# Altium schematic sheet Power.SchDoc
size A4
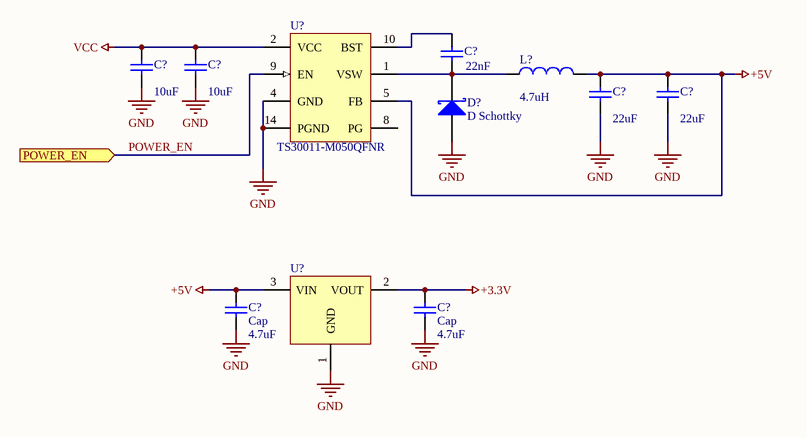
[diagram p0: Power.SchDoc]

## Parts
(Parts that share a designator on the sheet are numbered #1, #2 ... from top to bottom, then left to right.)
C?#1  value 22nF  [RAD-0.3]  (hidden comment: Cap)
C?#2  value 10uF  [RAD-0.3]  (hidden comment: Cap)
C?#3  value 10uF  [RAD-0.3]  (hidden comment: Cap)
C?#4  value 22uF  [RAD-0.3]  (hidden comment: Cap)
C?#5  value 22uF  [RAD-0.3]  (hidden comment: Cap)
C?#6  Cap  value 4.7uF  [RAD-0.3]
C?#7  Cap  value 4.7uF  [RAD-0.3]
D?  D Schottky  [SMB]
L?  value 4.7uH  [0402-A]  (hidden comment: Inductor)
U?#1  TS30011-M050QFNR  [QFN50P300X300X100_HS-17N]
U?#2  AP2114H-3.3TRG1  [SOT230P700X180-4N]  (value not drawn)

## Ports
POWER_EN (in)

## Nets
+3.3V: C?#7.2 U?#2.2(VOUT)
+5V: C?#4.2 C?#5.2 C?#6.2 L?.2 U?#1.5(FB) U?#2.3(VIN)
GND: C?#2.1 C?#3.1 C?#4.1 C?#5.1 C?#6.1 C?#7.1 D?.1(A) U?#1.4(GND) U?#1.14(PGND) U?#2.1(GND)
VCC: C?#2.2 C?#3.2 U?#1.2(VCC)
POWER_EN: U?#1.9(EN) ; port POWER_EN
NetC?#1_1: C?#1.1 D?.2(K) L?.1 U?#1.1(VSW)
NetC?#1_2: C?#1.2 U?#1.10(BST)

Not connected (* = marked no-connect by the designer): U?#1 3(VCC) 8(PG) 11(VCC) 12(VSW) 13(VSW) 15(PGND) 16(VSW)

## Library data of the parts
C?#1-C?#7 = Cap: Capacitor; Published: 8-Jun-2000; LatestRevisionDate: 17-Jul-2002; LatestRevisionNote: Re-released for DXP Platform.; PackageReference: RAD-0.3; Publisher: Altium Limited; PackageDescription: Radial Cap, Thru-Hole; 2 Leads; 0.3 in Pin Spacing
D? = D Schottky: Schottky Diode; Published: 8-Jun-2000; LatestRevisionDate: 17-Jul-2002; LatestRevisionNote: Re-released for DXP Platform.; PackageReference: SMB; Publisher: Altium Limited; PackageDescription: DO-214-AA/SMB; 2 C-Bend Leads; Body 5.3 x 3.6 mm, inc. leads (LxW); Code_JEDEC: DO-214-AA
L? = Inductor: Code_IEC: 1005; Published: 8-Jun-2000; LatestRevisionDate: 29-May-2009; LatestRevisionNote: IPC-7351 Footprint Added.; PackageReference: 0402-A; Publisher: Altium Limited; PackageDescription: Chip Inductor; Code_JEITA: 0402
U?#1 = TS30011-M050QFNR: Voltage Regulators - Switching Regulators IC Hi-Eff 1Amp DC/DC Conv 1MHz 5V Outpt; Manufacturer: Triune Systems; Max Input Voltage: 24V; Output Current: 1A; Min Input Voltage: 6V; Number of Outputs: 1; Efficiency: 95%; Supplier 1: Digi-Key; Manufacturer Part Number: TS30011-M050QFNR; Mount: Surface Mount; Case/Package: DFN EP; Number of Pins: 16; Min Operating Temperature: -40°C; Max Operating Temperature: 125°C; Packaging: Tape and Reel; Switching Frequency: 1MHz; Output Voltage: 5V; Package Quantity: 1000; Radiation Hardening: No; ComponentLink1URL: https://datasheet.ciiva.com/15191/getdatasheetpartid-720917-15191587.pdf; ComponentLink1Description: https://datasheet.ciiva.com/15191/getdatasheetpartid-720917-15191587.pdf; Supplier Part Number 1: TS30011-M050QFNRDKR-ND; Stock 1: 9394; Pricing 1: 1=1.08, 10=0.958, 25=0.8652, 100=0.7571, 250=0.6644, 500=0.5871, 1000=0.4635 (USD)
U?#2 = AP2114H-3.3TRG1: IC REG LDO 3.3V 1A SOT223; Manufacturer: Diodes; Number of Outputs: 1; Min Input Voltage: 2.5V; Max Input Voltage: 6V; Dropout Voltage: 450mV; Polarity: Positive; Quiescent Current: 65uA; Accuracy: 1.5%; Power Supply Rejection Ratio (PSRR): 65dB; Supplier 1: Digi-Key; Manufacturer Part Number: AP2114H-3.3TRG1; Mount: Surface Mount; Case/Package: TO-261-4; Weight: 0.000282oz; Min Operating Temperature: -40°C; Max Operating Temperature: 85°C; Packaging: Tape and Reel; Output Voltage: 3.3V; Package Quantity: 4000; Output Current: 1A; Number of Regulators: 1; Max Output Current: 1A; Length: 6.7mm; Height: 1.7mm; Width: 3.7mm; Lead Free: Lead Free; ComponentLink1URL: https://datasheet.ciiva.com/29569/ap2114-29569883.pdf; ComponentLink1Description: https://datasheet.ciiva.com/29569/ap2114-29569883.pdf; ComponentLink2URL: https://datasheet.ciiva.com/29569/ap2114-29569882.pdf; ComponentLink2Description: https://datasheet.ciiva.com/29569/ap2114-29569882.pdf; ComponentLink3URL: https://datasheet.ciiva.com/29569/ap2114-29569881.pdf; ComponentLink3Description: https://datasheet.ciiva.com/29569/ap2114-29569881.pdf; Supplier Part Number 1: AP2114H-3.3TRG1DIDKR-ND; Stock 1: 28139; Pricing 1: 1=0.36, 10=0.293, 100=0.1994, 500=0.1496, 1000=0.1122 (USD)